# Altium schematic sheet sheet.SchDoc
size A
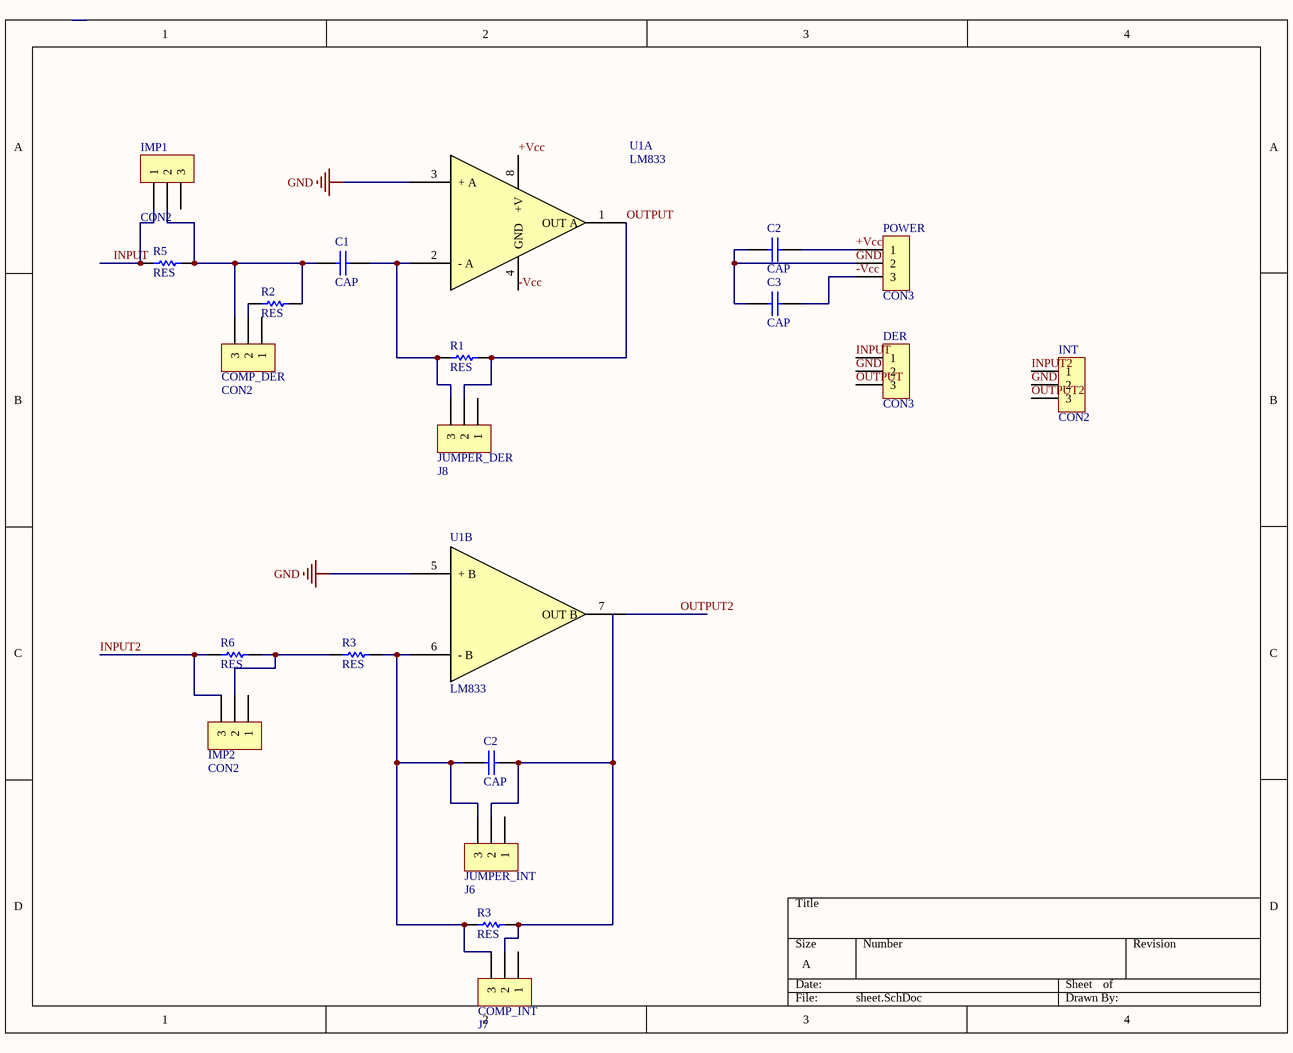
[diagram p0: sheet.SchDoc]

## Parts
(Parts that share a designator on the sheet are numbered #1, #2 ... from top to bottom, then left to right.)
C1  CAP  [CAP200]
C2#1  CAP  [CAP200]
C2#2  CAP  [CAP200]
C3  CAP  [CAP200]
COMP_DER  CON2  [SIP3]
COMP_INT  J7  [SIP3]
DER  CON3  [SIP3]
IMP1  CON2  [SIP3]
IMP2  CON2  [SIP3]
INT  CON2  [SIP3]
JUMPER_DER  J8  [SIP3]
JUMPER_INT  J6  [SIP3]
POWER  CON3  [SIP3]
R1  RES  [RES400]
R2  RES  [RES400]
R3#1  RES  [RES400]
R3#2  RES  [RES400]
R5  RES  [RES400]
R6  RES  [RES400]
U1  LM833  [DIP8]  (parts A,B of 2)

## Nets
GND: C2#1.1 C3.1 DER.2 INT.2 POWER.2 U1.3(+_A) U1.5(+_B)
+Vcc: C2#1.2 POWER.1 U1.8(+V)
-Vcc: C3.2 POWER.3 U1.4(GND)
INPUT: DER.1 IMP1.1 R5.1
INPUT2: IMP2.3 INT.1 R6.1
OUTPUT: DER.3 JUMPER_DER.2 R1.2 U1.1(OUT_A)
OUTPUT2: INT.3 U1.7(OUT_B)
NetC1_1: C1.1 COMP_DER.3 IMP1.2 R2.2 R5.2
NetC1_2: C1.2 JUMPER_DER.3 R1.1 U1.2(-_A)
NetC2#2_1: C2#2.1 COMP_INT.3 JUMPER_INT.3 R3#1.2 R3#2.1 U1.6(-_B)
NetC2#2_2: C2#2.2 COMP_INT.2 JUMPER_INT.2 R3#2.2
NetCOMP_DER_2: COMP_DER.2 R2.1
NetIMP2_2: IMP2.2 R3#1.1 R6.2

Not connected (* = marked no-connect by the designer): COMP_DER 1; COMP_INT 1; IMP1 3; IMP2 1; JUMPER_DER 1; JUMPER_INT 1

## Library data of the parts
COMP_DER COMP_INT IMP1 IMP2 INT JUMPER_DER JUMPER_INT = CON3
U1 = LM833: Dual Audio Operational Amplifier